# Altium schematic sheet Part B.SchDoc
size A4; SheetNumber: 9; SheetTotal: 16
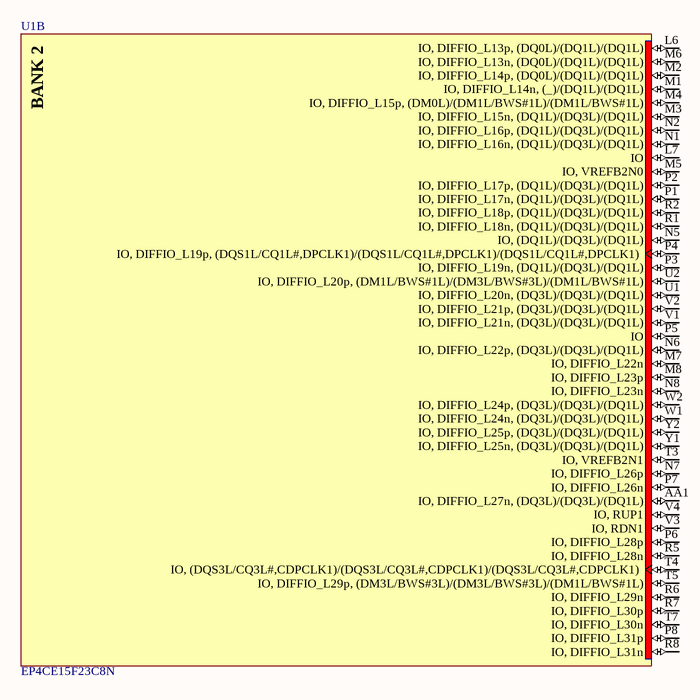
[diagram p0: Part B.SchDoc]

## Parts
U1  EP4CE15F23C8N  [FBGA484_A-240]  (part B of 13)

## Nets

Not connected (* = marked no-connect by the designer): U1 AA1(IO,_DIFFIO_L27n,_(DQ3L)/(DQ3L)/(DQ1L)) L6(IO,_DIFFIO_L13p,_(DQ0L)/(DQ1L)/(DQ1L)) L7(IO) M1(IO,_DIFFIO_L14n,_(_)/(DQ1L)/(DQ1L)) M2(IO,_DIFFIO_L14p,_(DQ0L)/(DQ1L)/(DQ1L)) M3(IO,_DIFFIO_L15n,_(DQ1L)/(DQ3L)/(DQ1L)) M4(IO,_DIFFIO_L15p,_(DM0L)/(DM1L/BWS#1L)/(DM1L/BWS#1L)) M5(IO,_VREFB2N0) M6(IO,_DIFFIO_L13n,_(DQ0L)/(DQ1L)/(DQ1L)) M7(IO,_DIFFIO_L22n) M8(IO,_DIFFIO_L23p) N1(IO,_DIFFIO_L16n,_(DQ1L)/(DQ3L)/(DQ1L)) N2(IO,_DIFFIO_L16p,_(DQ1L)/(DQ3L)/(DQ1L)) N5(IO,_(DQ1L)/(DQ3L)/(DQ1L)) N6(IO,_DIFFIO_L22p,_(DQ3L)/(DQ3L)/(DQ1L)) N7(IO,_DIFFIO_L26p) N8(IO,_DIFFIO_L23n) P1(IO,_DIFFIO_L17n,_(DQ1L)/(DQ3L)/(DQ1L)) P2(IO,_DIFFIO_L17p,_(DQ1L)/(DQ3L)/(DQ1L)) P3(IO,_DIFFIO_L19n,_(DQ1L)/(DQ3L)/(DQ1L)) P4(IO,_DIFFIO_L19p,_(DQS1L/CQ1L#,DPCLK1)/(DQS1L/CQ1L#,DPCLK1)/(DQS1L/CQ1L#,DPCLK1)) P5(IO) P6(IO,_DIFFIO_L28p) P7(IO,_DIFFIO_L26n) P8(IO,_DIFFIO_L31p) R1(IO,_DIFFIO_L18n,_(DQ1L)/(DQ3L)/(DQ1L)) R2(IO,_DIFFIO_L18p,_(DQ1L)/(DQ3L)/(DQ1L)) R5(IO,_DIFFIO_L28n) R6(IO,_DIFFIO_L29n) R7(IO,_DIFFIO_L30p) R8(IO,_DIFFIO_L31n) T3(IO,_VREFB2N1) T4(IO,_(DQS3L/CQ3L#,CDPCLK1)/(DQS3L/CQ3L#,CDPCLK1)/(DQS3L/CQ3L#,CDPCLK1)) T5(IO,_DIFFIO_L29p,_(DM3L/BWS#3L)/(DM3L/BWS#3L)/(DM1L/BWS#1L)) T7(IO,_DIFFIO_L30n) U1(IO,_DIFFIO_L20n,_(DQ3L)/(DQ3L)/(DQ1L)) U2(IO,_DIFFIO_L20p,_(DM1L/BWS#1L)/(DM3L/BWS#3L)/(DM1L/BWS#1L)) V1(IO,_DIFFIO_L21n,_(DQ3L)/(DQ3L)/(DQ1L)) V2(IO,_DIFFIO_L21p,_(DQ3L)/(DQ3L)/(DQ1L)) V3(IO,_RDN1) V4(IO,_RUP1) W1(IO,_DIFFIO_L24n,_(DQ3L)/(DQ3L)/(DQ1L)) W2(IO,_DIFFIO_L24p,_(DQ3L)/(DQ3L)/(DQ1L)) Y1(IO,_DIFFIO_L25n,_(DQ3L)/(DQ3L)/(DQ1L)) Y2(IO,_DIFFIO_L25p,_(DQ3L)/(DQ3L)/(DQ1L))

## Notes on the sheet
- (in symbol FPGA_EP4CE15F23C8N, part B) BANK 2

## Library data of the parts
U1 = FPGA_EP4CE15F23C8N: Cyclone IV Family FPGA, 1.2V Core, 343 I/O Pins, 4 PLLs, 484-Pin FBGA, Speed Grade 8, Commercial Grade, Pb-Free; Manufacturer: Altera; PackageVersion: ver1.0, Jun-2011; PackageReference: FBGA484_A-240; ComponentLink3URL: http://www.altera.com/literature/lit-dp.jsp?category=cyc%204&showspreadsheet=y; ComponentLink1Description: Manufacturer URL; DatasheetVersion: ver1.6, Nov-2011; ComponentLink3Description: Pinout; ComponentLink2URL: http://www.altera.com/literature/hb/cyclone-iv/cyclone4-handbook.pdf; ComponentLink1URL: http://www.altera.com/; ComponentLink2Description: Handbook; PackageDescription: 484-Pin FineLine Ball Grid Array (FBGA) - Wire Bond - A:2.40; Code_JEDEC: MS-034-AAJ-1; ComponentLink4URL: http://www.altera.com/devicepackaging/04R00247-02.pdf; ComponentLink4Description: Package Specification